# Altium schematic sheet [03] - BUTTONS-AND-SPI.SchDoc
size A3; DocumentNumber: 3; SheetNumber: 3; SheetTotal: 6
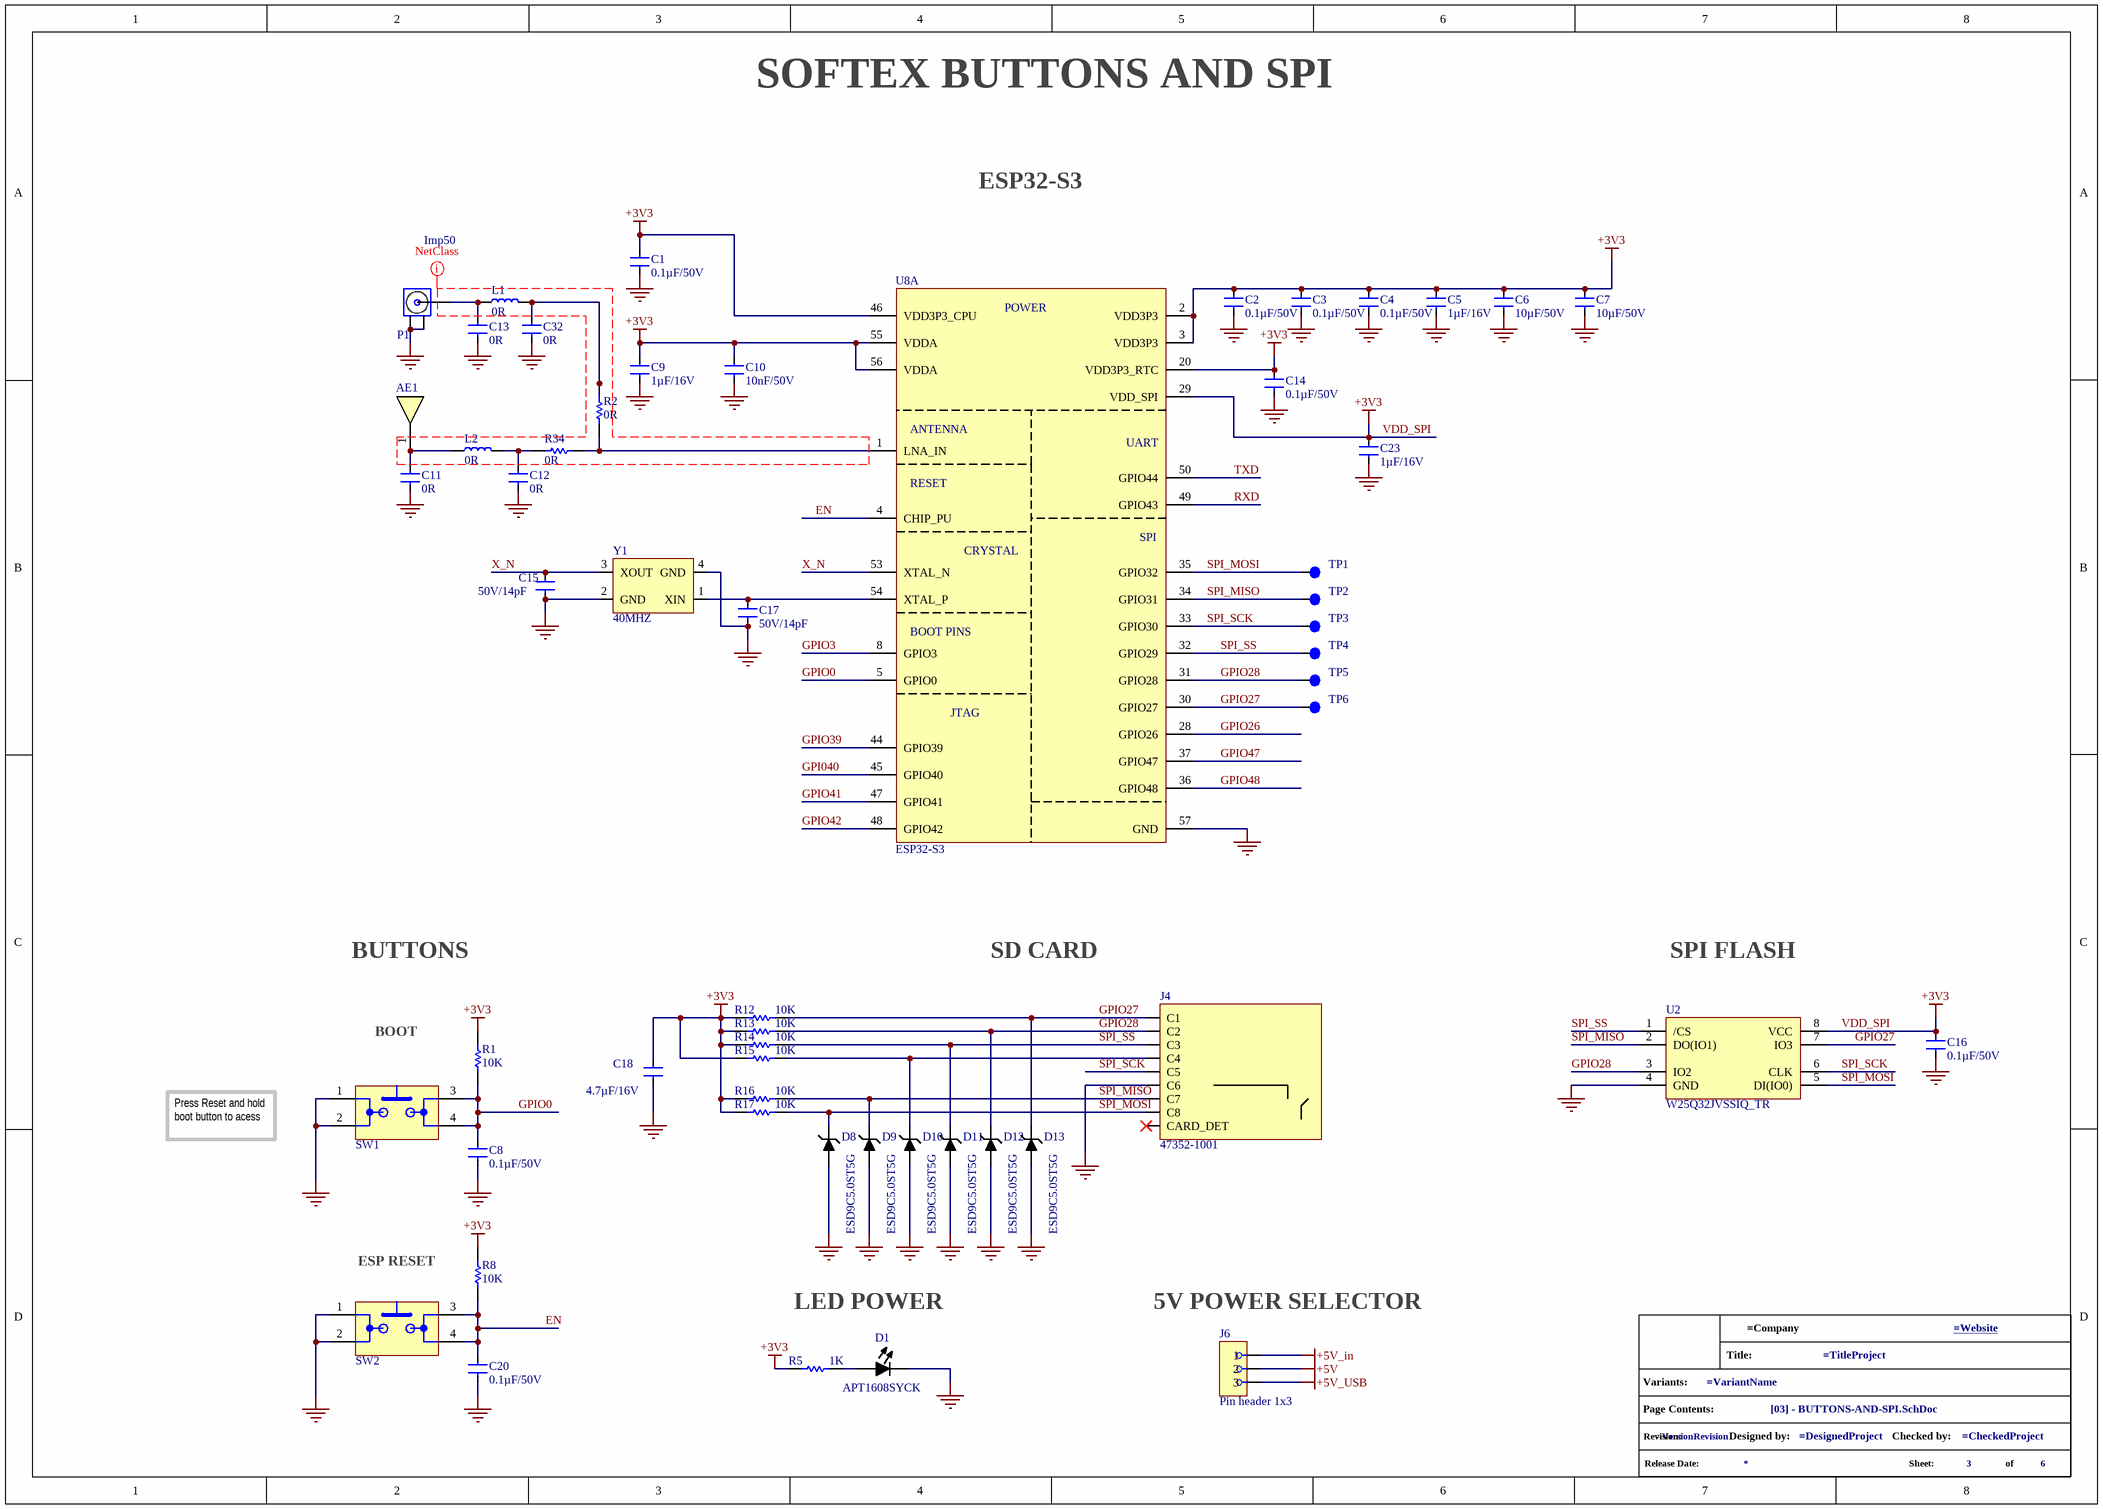
[diagram p0: [03] - BUTTONS-AND-SPI.SchDoc]

## Parts
*?  info_project  (value not drawn)  (graphical)
AE1  2450AT45A100E  [2450AT45A100E]  (value not drawn)
C1  0.1µF/50V  [C0805]
C2  0.1µF/50V  [C0805]
C3  0.1µF/50V  [C0805]
C4  0.1µF/50V  [C0805]
C5  1µF/16V  [C0805]
C6  10µF/50V  [C0805]
C7  10µF/50V  [C0805]
C8  0.1µF/50V  [C0805]
C9  1µF/16V  [C0805]
C10  10nF/50V  [C0805]
C11  0R  [C0402]
C12  0R  [C0402]
C13  0R  [C0402]
C14  0.1µF/50V  [C0805]
C15  50V/14pF  [C0402]
C16  0.1µF/50V  [C0805]
C17  50V/14pF  [C0402]
C18  4.7µF/16V  [C0805]
C20  0.1µF/50V  [C0805]
C23  1µF/16V  [C0805]
C32  0R  [C0402]
D1  APT1608SYCK  [APT1608SYCK]
D8  ESD9C5.0ST5G  [ESD9C5.0ST5G]
D9  ESD9C5.0ST5G  [ESD9C5.0ST5G]
D10  ESD9C5.0ST5G  [ESD9C5.0ST5G]
D11  ESD9C5.0ST5G  [ESD9C5.0ST5G]
D12  ESD9C5.0ST5G  [ESD9C5.0ST5G]
D13  ESD9C5.0ST5G  [ESD9C5.0ST5G]
J4  47352-1001  [SDCARD-0473521001]
J6  Pin header 1x3  [PH1-03-UA]
L1  0R  [L0402]
L2  0R  [L0402]
P1  U.FL-R-SMT-1(10)  [U.FL-R-SMT-1(10)]  (value not drawn)
R1  10K  [R0805]
R2  0R  [R0402]
R5  1K  [R0805]
R8  10K  [R0805]
R12  10K  [R0805]
R13  10K  [R0805]
R14  10K  [R0805]
R15  10K  [R0805]
R16  10K  [R0805]
R17  10K  [R0805]
R34  0R  [R0402]
SW1  BUTTON  [BUTTON]  (value not drawn)
SW2  BUTTON  [BUTTON]  (value not drawn)
TP1  TestPoint  [Test Point]  (value not drawn)  (no BOM)
TP2  TestPoint  [Test Point]  (value not drawn)  (no BOM)
TP3  TestPoint  [Test Point]  (value not drawn)  (no BOM)
TP4  TestPoint  [Test Point]  (value not drawn)  (no BOM)
TP5  TestPoint  [Test Point]  (value not drawn)  (no BOM)
TP6  TestPoint  [Test Point]  (value not drawn)  (no BOM)
U2  W25Q32JVSSIQ_TR  [SOIC127P790X216-8N]
U8  ESP32-S3  [ESP32-S3]  (part A of 2)
Y1  40MHZ  [RH100-40.000-10-F-1010-TR]

## Nets
+5V: J6.2
+5V_in: J6.1
+5V_USB: J6.3
GND: C1.1 C2.1 C3.1 C4.1 C5.1 C6.1 C7.1 C8.1 C9.1 C10.1 C11.1 C12.1 C13.1 C14.2 C15.1 C16.1 C17.1 C18.1 C20.1 C23.1 C32.1 D1.2 D8.2(Anode) D9.2(Anode) D10.2(Anode) D11.2(Anode) D12.2(Anode) D13.2(Anode) J4.6(C6) P1.2 P1.3 SW1.1 SW1.2 SW2.1 SW2.2 U2.4(GND) U8.57(GND) Y1.2(GND) Y1.4(GND)
VDD_SPI: C1.2 C2.2 C3.2 C4.2 C5.2 C6.2 C7.2 C9.2 C10.2 C14.1 C16.2 C18.2 C23.2 R1.2 R5.1 R8.2 R12.1 R13.1 R14.1 R15.1 R16.1 R17.1 U2.8(VCC) U8.2(VDD3P3) U8.3(VDD3P3) U8.20(VDD3P3_RTC) U8.29(VDD_SPI) U8.46(VDD3P3_CPU) U8.55(VDDA) U8.56(VDDA)  [also labelled +3V3]
EN: C20.2 R8.1 SW2.3 SW2.4 U8.4(CHIP_PU)
GPI040: U8.45(GPIO40)
GPIO0: C8.2 R1.1 SW1.3 SW1.4 U8.5(GPIO0)
GPIO3: U8.8(GPIO3)
GPIO26: U8.28(GPIO26)
GPIO27: D13.1(Cathode) J4.1(C1) R12.2 TP6.1 U2.7(IO3) U8.30(GPIO27)
GPIO28: D12.1(Cathode) J4.2(C2) R13.2 TP5.1 U2.3(IO2) U8.31(GPIO28)
GPIO39: U8.44(GPIO39)
GPIO41: U8.47(GPIO41)
GPIO42: U8.48(GPIO42)
GPIO47: U8.37(GPIO47)
GPIO48: U8.36(GPIO48)
RXD: U8.49(GPIO43)
SPI_MISO: D9.1(Cathode) J4.7(C7) R16.2 TP2.1 U2.2(DO(IO1)) U8.34(GPIO31)
SPI_MOSI: D8.1(Cathode) J4.8(C8) R17.2 TP1.1 U2.5(DI(IO0)) U8.35(GPIO32)
SPI_SCK: J4.5(C5) TP3.1 U2.6(CLK) U8.33(GPIO30)
SPI_SS: D11.1(Cathode) J4.3(C3) R14.2 TP4.1 U2.1(/CS) U8.32(GPIO29)
TXD: U8.50(GPIO44)
X_N: C15.2 U8.53(XTAL_N) Y1.3(XOUT)
NetAE1_1: AE1.1(Feeding_Point) C11.2 L2.1
NetC12_2: C12.2 L2.2 R34.2
NetC13_2: C13.2 L1.1 P1.1
NetC17_2: C17.2 U8.54(XTAL_P) Y1.1(XIN)
NetC32_2: C32.2 L1.2 R2.2
NetD1_1: D1.1 R5.2
NetD10_1: D10.1(Cathode) J4.4(C4) R15.2
NetR2_1: R2.1 R34.1 U8.1(LNA_IN)

Not connected (* = marked no-connect by the designer): J4 9(CARD_DET)*

## Layout directives
net class Imp50: +3V3, GND

## Notes on the sheet
- SOFTEX BUTTONS AND SPI
- ESP32-S3
- BUTTONS
- SD CARD
- SPI FLASH
- BOOT
- Press Reset and hold boot button to acess bootloader
- ESP RESET
- LED POWER
- (near J6) 5V POWER SELECTOR
- (in symbol ESP32-S3, part A) POWER; ANTENNA; UART; RESET; SPI; CRYSTAL; BOOT PINS; JTAG
- (in symbol info_project) Title:; Variants:; Page Contents:; Revision:; Designed by:; Checked by:; Release Date:; Sheet:; of

## Library data of the parts
*? = info_project: GRAPHICAL - Info Project
AE1 = 2450AT45A100E: RF ANT - 2.4GHZ CHIP SOLDER SMD; Manufacturer 1: Johanson; Impedance: 50R; Power Rating: 3W; Bandwidth: 100MHz; Number of Bands: 1; Return Loss: -9.5dB; Frequency: 2.45GHz; Gain: 1dB; Max Frequency: 2.5GHz; .SCHChecked: Alex Batista; Supplier 1: Digi-Key; Manufacturer Part Number 1: 2450AT45A100E; Stock 1: 275; Pricing 1: 1=0.94000, 10=0.84100, 25=0.79800, 100=0.65550, 250=0.61276, 500=0.54150 (USD); RoHS: Yes; Mount: Surface Mount; Number of Pins: 2; Min Operating Temperature: -40°C; Max Operating Temperature: 85°C; Package Quantity: 1; Packaging: Tape and Reel; Max Power Dissipation: 3W; Termination: Solder; Resistor Type: Ceramic; Length: 9.5mm; Width: 2mm; Height: 0.047inch; Radiation Hardening: No; REACH SVHC: No SVHC; ComponentLink1URL: https://datasheet.ciiva.com/1126/1296113-1126176.pdf?src-supplier=Newark; ComponentLink1Description: https://datasheet.ciiva.com/1126/1296113-1126176.pdf?src-supplier=Newark; ComponentLink2URL: https://datasheet.ciiva.com/2791/jti-antenna-2450at45a100-2006-07-2791936.pdf?src-supplier=Digi-Key; ComponentLink2Description: https://datasheet.ciiva.com/2791/jti-antenna-2450at45a100-2006-07-2791936.pdf?src-supplier=Digi-Key; ComponentLink3URL: https://datasheet.ciiva.com/6748/antenna-2450at45a100-v5-6748578.pdf?src-supplier=Newark; ComponentLink3Description: https://datasheet.ciiva.com/6748/antenna-2450at45a100-v5-6748578.pdf?src-supplier=Newark; ComponentLink4URL: https://datasheet.ciiva.com/24068/antenna-2450at45a100-v5-242465-24068002.pdf?src-supplier=Mouser; ComponentLink4Description: https://datasheet.ciiva.com/24068/antenna-2450at45a100-v5-242465-24068002.pdf?src-supplier=Mouser; ComponentLink5URL: https://datasheet.ciiva.com/2791/jti-antenna-2450at45a100-2006-07-2791937.pdf?src-supplier=Digi-Key; ComponentLink5Description: https://datasheet.ciiva.com/2791/jti-antenna-2450at45a100-2006-07-2791937.pdf?src-supplier=Digi-Key; ComponentLink6URL: https://datasheet.ciiva.com/2791/jti-antenna-2450at45a100-2006-07-2791938.pdf?src-supplier=Digi-Key; ComponentLink6Description: https://datasheet.ciiva.com/2791/jti-antenna-2450at45a100-2006-07-2791938.pdf?src-supplier=Digi-Key; ComponentLink7URL: https://datasheet.ciiva.com/1124/1318299-1124920.pdf?src-supplier=Element14; ComponentLink7Description: https://datasheet.ciiva.com/1124/1318299-1124920.pdf?src-supplier=Element14; Supplier Part Number 1: 712-1012-1-ND; .PCBChecked: Alex Batista
C1-C4 C8 C14 C16 C20 = CL21B104KBCNNNC: MLCC - 0.1µF 0805 50V X7R ±10%; Manufacturer 1: Samsung; .SCHChecked: Victor Holanda; Material: Ceramic; Capacitance: 100nF; .PCBChecked: Victor Holanda; Supplier 1: Digi-Key; RoHS: Yes; Category: Ceramic Capacitors; Stock 1: 3198898; Pricing 1: 1=0,10000, 10=0,04800, 50=0,02620, 100=0,02140, 500=0,01528, 1000=0,01201 (USD); Mount: Surface Mount; Case/Package: 0805; Case Code (Metric): 2012; Case Code (Imperial): 0805; Contact Plating: Tin; Min Operating Temperature: -55°C; Max Operating Temperature: 125°C; Tolerance: 10%; Dielectric: X7R; Packaging: Tape and Reel; Voltage Rating: 50V; Voltage: 50V; Voltage Rating (DC): 50V; Series: CL; Construction: Flat; Length: 2mm; Width: 0.049inch; Height: 0.85mm; Depth: 1.25mm; Thickness: 0.037inch; Radiation Hardening: No; Lead Free: Lead Free; RoHS Compliant: Yes; ComponentLink3URL: https://datasheet.ciiva.com/25710/cl21b104kbcnnnc-25710182.pdf?src-supplier=Digi-Key; ComponentLink3Description: https://datasheet.ciiva.com/25710/cl21b104kbcnnnc-25710182.pdf?src-supplier=Digi-Key; Supplier 2: Mouser; Supplier Part Number 1: 1276-1003-1-ND; Supplier Part Number 2: 187-CL21B104KBCNNNC; Manufacturer Part Number 1: CL21B104KBCNNNC
C5 C9 C23 = CL21B105KOFNNNE: MLCC - 1µF 0805 16V X7R ±10%; Manufacturer 1: Samsung; .SCHChecked: Victor Holanda; Capacitance: 1uF; .PCBChecked: Victor Holanda; Supplier 1: Digi-Key; RoHS: Yes; Category: Ceramic Capacitors; Stock 1: 1044699; Pricing 1: 1=0,10000, 10=0,05600, 50=0,03060, 100=0,02500, 500=0,01782, 1000=0,01401 (USD); Mount: Surface Mount; Case/Package: 0805; Case Code (Metric): 2012; Case Code (Imperial): 0805; Contact Plating: Tin; Min Operating Temperature: -55°C; Max Operating Temperature: 125°C; Tolerance: 10%; Package Quantity: 1; Packaging: Tape and Reel; Voltage Rating: 16V; Dielectric: X7R; Voltage Rating (DC): 16V; Series: CL; Construction: Flat; Voltage: 16V; Length: 2mm; Width: 0.049inch; Height: 1.25mm; Thickness: 0.053inch; Depth: 1.25mm; Radiation Hardening: No; Lead Free: Lead Free; RoHS Compliant: Yes; ComponentLink3URL: https://datasheet.ciiva.com/25800/cl21b105kofnnne-25800257.pdf?src-supplier=Digi-Key; ComponentLink3Description: https://datasheet.ciiva.com/25800/cl21b105kofnnne-25800257.pdf?src-supplier=Digi-Key; Supplier Part Number 1: 1276-1026-1-ND; Manufacturer Part Number 1: CL21B105KOFNNNE
C6 C7 = GRM21BR61H106ME43L: MLCC - 10µF 0805 50V X7R ±20%; Manufacturer  1: Murata; .SCHChecked: Victor Holanda; .PCBChecked: Victor Holanda; Supplier 1: Digi-Key; RoHS: Yes; Category: Ceramic Capacitors; Stock 1: 199741; Pricing 1: 1=0,42000, 10=0,29400, 50=0,20560, 100=0,17620, 500=0,13216, 1000=0,11161 (USD); Supplier Part Number 1: 490-18664-1-ND; Manufacturer Part Number 1: GRM21BR61H106ME43L
C10 = CL21B103KBCNNNC: MLCC - 10nF 0805 50V X7R ±10%; Manufacturer 1: Samsung; .SCHChecked: Victor Holanda; .PCBChecked: Victor Holanda; Supplier 1: Digi-Key; RoHS: Yes; Category: Ceramic Capacitors; Stock 1: 106601; Pricing 1: 1=0,10000, 10=0,05000, 50=0,02700, 100=0,02210, 500=0,01578, 1000=0,01240 (USD); Mount: Surface Mount; Case/Package: 0805; Case Code (Metric): 2012; Case Code (Imperial): 0805; Contact Plating: Tin; Min Operating Temperature: -55°C; Max Operating Temperature: 125°C; Voltage Rating: 50V; Packaging: Tape and Reel; Capacitance: 10nF; Tolerance: 10%; Dielectric: X7R; Voltage Rating (DC): 50V; Series: CL; Construction: Flat; Length: 2mm; Width: 0.049inch; Height: 0.85mm; Thickness: 0.037inch; Depth: 1.25mm; Radiation Hardening: No; Lead Free: Lead Free; RoHS Compliant: Yes; ComponentLink6URL: https://datasheet.ciiva.com/26920/getdatasheetpartid-640087-26920198.pdf?src-supplier=Verical; ComponentLink6Description: https://datasheet.ciiva.com/26920/getdatasheetpartid-640087-26920198.pdf?src-supplier=Verical; Supplier Part Number 1: 1276-1078-1-ND; Manufacturer Part Number 1: CL21B103KBCNNNC
C11-C13 C32 = C_0402_JUMPER: MLCC - 0R 0402 JUMPER; Manufacturer 1: Vishay; Manufacturer Part Number 1: CRCW04020000Z0EDC; .SCHChecked: Victor Holanda; Power Rating: 62.5mW; Resistance: 18R; .PCBChecked: Victor Holanda; Supplier 1: Digi-Key; RoHS: Yes; Category: Chip SMD Resistors; Stock 1: 109511; Pricing 1: 1=0,10000, 10=0,02300, 100=0,00950, 1000=0,00427, 2500=0,00370, 5000=0,00306 (USD); Mount: Surface Mount; Case/Package: Molded; Contact Plating: Tin; Min Operating Temperature: -55°C; Max Operating Temperature: 155°C; Resistor Type: Thick Film; Termination: Wraparound; Length: 1mm; Lead Free: Lead Free; RoHS Compliant: Yes; ComponentLink1URL: http://www.vishay.com/docs/28773/crcwce3.pdf?src-supplier=Digi-Key; ComponentLink1Description: http://www.vishay.com/docs/28773/crcwce3.pdf?src-supplier=Digi-Key; ComponentLink2URL: http://www.vishay.com/docs/20035/dcrcwe3.pdf?src-supplier=Avnet; ComponentLink2Description: http://www.vishay.com/docs/20035/dcrcwe3.pdf?src-supplier=Avnet; Supplier Part Number 1: 541-4062-1-ND
C15 C17 = 04025U140FAT2A: MLCC - 14pF 0402 50V NP0 ±1%; Manufacturer 1: Kyocera AVX; Dielectric: C0G; .PCBChecked: Victor H; Supplier 1: Digi-Key; Manufacturer Part Number 1: 04025U140FAT2A; RoHS: Yes; Category: Ceramic Capacitors; Stock 1: 104186; Pricing 1: 1=0,37000, 10=0,25100, 50=0,16760, 100=0,14250, 500=0,10058, 1000=0,08801, 2500=0,08382, 5000=0,07753 (USD); Mount: Surface Mount; Case/Package: 0402; Case Code (Imperial): 0402; Case Code (Metric): 1005; Min Operating Temperature: -55°C; Max Operating Temperature: 125°C; Capacitance: 14pF; Package Quantity: 10000; Voltage Rating: 50V; Voltage Rating (DC): 50V; Tolerance: 1%; Packaging: Tape and Reel; Termination: SMD/SMT; Resistor Type: Ceramic; Series: U; Construction: Flat; Length: 1mm; Width: 0.5mm; Thickness: 0.022inch; Depth: 0.5mm; Radiation Hardening: No; RoHS Compliant: Yes; ComponentLink1URL: https://datasheet.ciiva.com/11568/useries-11568551.pdf?src-supplier=Avnet; ComponentLink1Description: https://datasheet.ciiva.com/11568/useries-11568551.pdf?src-supplier=Avnet; ComponentLink2URL: https://datasheet.ciiva.com/6269/useries-6269558.pdf?src-supplier=Digi-Key; ComponentLink2Description: https://datasheet.ciiva.com/6269/useries-6269558.pdf?src-supplier=Digi-Key; Supplier Part Number 1: 478-10139-1-ND; .SCHChecked: Victor H
C18 = CL21A475KOFNNNE: MLCC - 4.7µF 0805 16V X5R ±10%; Manufacturer 1: Samsung; .SCHChecked: Victor Holanda; Capacitance: 4.7uF; .PCBChecked: Victor Holanda; Supplier 1: Digi-Key; Manufacturer Part Number 1: CL21A475KOFNNNE; RoHS: Yes; Category: Ceramic Capacitors; Stock 1: 605133; Pricing 1: 1=0,12000, 10=0,08600, 50=0,04880, 100=0,04050, 500=0,02838, 1000=0,02350 (USD); Mount: Surface Mount; Case/Package: 0805; Case Code (Metric): 2012; Case Code (Imperial): 0805; Contact Plating: Tin; Min Operating Temperature: -55°C; Max Operating Temperature: 85°C; Packaging: Tape and Reel; Tolerance: 10%; Voltage Rating: 16V; Dielectric: X5R; Series: CL; Construction: Flat; Length: 2mm; Width: 0.049inch; Height: 1.25mm; Thickness: 0.053inch; Depth: 1.25mm; Radiation Hardening: No; RoHS Compliant: Yes; ComponentLink3URL: https://datasheet.ciiva.com/25710/cl21a475kofnnne-25710354.pdf?src-supplier=Digi-Key; ComponentLink3Description: https://datasheet.ciiva.com/25710/cl21a475kofnnne-25710354.pdf?src-supplier=Digi-Key; ComponentLink4URL: https://datasheet.ciiva.com/16740/cl21a475kofnnne-16740646.pdf?src-supplier=Future+Electronics; ComponentLink4Description: https://datasheet.ciiva.com/16740/cl21a475kofnnne-16740646.pdf?src-supplier=Future+Electronics; ComponentLink5URL: https://datasheet.ciiva.com/26838/getdatasheetpartid-357424-26838625.pdf?src-supplier=Verical; ComponentLink5Description: https://datasheet.ciiva.com/26838/getdatasheetpartid-357424-26838625.pdf?src-supplier=Verical; Supplier Part Number 1: 1276-1065-1-ND
D1 = APT1608SYCK: LED - APT1608SYCK Yellow LED; 590 nm 1608 (0603) Clear; Rectangle Lens SMD package; Manufacturer: Kingbright; .SCHChecked: Victor H; Viewing Angle: 120°; Forward Current: 20mA; Forward Voltage: 2V; Luminous Intensity: 150mcd; Dominant Wavelength: 590nm; Lens Style: Clear,Flat; Number of LEDs: 1; .PCBChecked: Victor H; mounting: SMD; Supplier 1: Digi-Key; Manufacturer Part Number: APT1608SYCK; RoHS: Yes; Category: LEDs; Stock 1: 448438; Pricing 1: 1=0,31000, 10=0,24100, 100=0,10840, 500=0,09794, 1000=0,08045 (USD); Mount: Surface Mount; Case/Package: 0603; Number of Pins: 2; Lens Color: Clear; Color: Yellow; Case Code (Metric): 1608; Case Code (Imperial): 0603; Min Operating Temperature: -40°C; Max Operating Temperature: 85°C; Package Quantity: 2000; Packaging: Tape and Reel; Illumination Color: Yellow; Test Current: 20mA; Wavelength: 590nm; Series: APT; Length: 1.6mm; Width: 0.8mm; Height: 0.75mm; Lead Free: Lead Free; RoHS Compliant: Yes; ComponentLink1URL: https://datasheet.ciiva.com/2113/apt1608syck-2113824.pdf?src-supplier=Digi-Key; ComponentLink1Description: https://datasheet.ciiva.com/2113/apt1608syck-2113824.pdf?src-supplier=Digi-Key; ComponentLink2URL: https://datasheet.ciiva.com/4688/apt1608syck-35136-4688900.pdf?src-supplier=Mouser; ComponentLink2Description: https://datasheet.ciiva.com/4688/apt1608syck-35136-4688900.pdf?src-supplier=Mouser; ComponentLink3URL: https://datasheet.ciiva.com/2113/apt1608syck-2113825.pdf?src-supplier=Digi-Key; ComponentLink3Description: https://datasheet.ciiva.com/2113/apt1608syck-2113825.pdf?src-supplier=Digi-Key; ComponentLink4URL: https://datasheet.ciiva.com/2113/apt1608syck-2113826.pdf?src-supplier=Digi-Key; ComponentLink4Description: https://datasheet.ciiva.com/2113/apt1608syck-2113826.pdf?src-supplier=Digi-Key; ComponentLink5URL: https://datasheet.ciiva.com/14603/70062842-14603786.pdf?src-supplier=Allied+Electronics; ComponentLink5Description: https://datasheet.ciiva.com/14603/70062842-14603786.pdf?src-supplier=Allied+Electronics; Supplier Part Number 1: 754-1124-1-ND
D8-D13 = ESD9C5.0ST5G: DIODE - TVS 5V SOD923; Manufacturer: ON Semiconductor; Capacitance: 6.2pF; Number of Elements: 1; Reverse Breakdown Voltage: 11V; Direction: Unidirectional; Power Line Protection: No; Leakage Current: 500nA; Test Current: 1mA; Max Power Dissipation: 150mW; Clamping Voltage: 10V; ESD Protection: Yes; Element Configuration: Single; Diode Type: ZENER; .SCHChecked: Alex Batista; Supplier 1: Digi-Key; Manufacturer Part Number: ESD9C5.0ST5G; RoHS: Yes; Category: ESD and Circuit Protection ICs; Stock 1: 4445; Pricing 1: 1=0,32000, 10=0,25900, 100=0,13720, 500=0,09024, 1000=0,06136, 2000=0,05535 (USD); Case/Package: SOD-923-2; Number of Pins: 2; Min Operating Temperature: -55°C; Max Operating Temperature: 150°C; Package Quantity: 1; Number of Channels: 1; Operating Supply Voltage: 5V; Packaging: Tape and Reel; Number of Unidirectional Channels: 1; Reverse Standoff Voltage: 5V; Min Breakdown Voltage: 11V; Breakdown Voltage: 11V; Polarity: Unidirectional; Termination: SMD/SMT; Working Voltage: 5V; Max Breakdown Voltage: 11V; Peak Pulse Power: 150mW; Max Reverse Leakage Current: 500nA; Number of Lines: 1; Resistor Type: Zener; Series: Automotive, AEC-Q101; Clamping Voltage-Max: 10V; Length: 0.8mm; Width: 0.65mm; Height: 0.4mm; Depth: 0.6mm; Radiation Hardening: No; REACH SVHC: No SVHC; Lead Free: Lead Free; Halogen Free: Halogen Free; RoHS Compliant: Yes; ComponentLink1URL: https://datasheet.ciiva.com/1219/1748974-1219321.pdf?src-supplier=Newark; ComponentLink1Description: https://datasheet.ciiva.com/1219/1748974-1219321.pdf?src-supplier=Newark; ComponentLink2URL: https://datasheet.ciiva.com/4509/esd9c3-3s-d-241629-4509822.pdf?src-supplier=Mouser; ComponentLink2Description: https://datasheet.ciiva.com/4509/esd9c3-3s-d-241629-4509822.pdf?src-supplier=Mouser; ComponentLink3URL: https://datasheet.ciiva.com/15143/getdatasheetpartid-53763-15143125.pdf?src-supplier=Verical; ComponentLink3Description: https://datasheet.ciiva.com/15143/getdatasheetpartid-53763-15143125.pdf?src-supplier=Verical; ComponentLink4URL: https://datasheet.ciiva.com/339/esd9c3-3s-d-339778.pdf?src-supplier=Digi-Key; ComponentLink4Description: https://datasheet.ciiva.com/339/esd9c3-3s-d-339778.pdf?src-supplier=Digi-Key; ComponentLink5URL: https://datasheet.ciiva.com/11195/esd9c3-3s-d-11195341.pdf?src-supplier=Avnet; ComponentLink5Description: https://datasheet.ciiva.com/11195/esd9c3-3s-d-11195341.pdf?src-supplier=Avnet; ComponentLink6URL: https://datasheet.ciiva.com/339/esd9c3-3s-d-339779.pdf?src-supplier=Digi-Key; ComponentLink6Description: https://datasheet.ciiva.com/339/esd9c3-3s-d-339779.pdf?src-supplier=Digi-Key; ComponentLink7URL: https://datasheet.ciiva.com/339/esd9c3-3s-d-339780.pdf?src-supplier=Digi-Key; ComponentLink7Description: https://datasheet.ciiva.com/339/esd9c3-3s-d-339780.pdf?src-supplier=Digi-Key; Supplier Part Number 1: ESD9C5.0ST5GOSCT-ND; .PCBChecked: Alex Batista
J4 = 47352-1001: CONN - Micro SD Card HDR 8 POS 1.1mm Solder RA SMD 0.5A/Contact Embossed T/R; Manufacturer 1: Molex; Number of Contacts: 8; Gender: Male; Connector Type: Connector; Max Voltage Rating (DC): 100V; Current Rating: 500mA; .SCHChecked: Alex Batista; Supplier 1: Digi-Key; RoHS: Yes; Category: Memory Connectors; Stock 1: 14775; Pricing 1: 1=3,58000, 10=3,15500, 100=2,50930 (USD); Mount: Surface Mount; Contact Material: Stainless Steel,Copper Alloy,Copper; Contact Plating: Gold; Housing Material: Polymer; Min Operating Temperature: -20°C; Max Operating Temperature: 85°C; Number of Rows: 1; Packaging: Tape and Reel; Orientation: Right Angle; Package Quantity: 1; Termination: SMD/SMT; Series: 47352; Voltage Rating (DC): 100V; Length: 14mm; Width: 1.88mm; Pitch: 1.1mm; Depth: 15.2mm; Radiation Hardening: No; REACH SVHC: Unknown; ComponentLink1URL: https://datasheet.ciiva.com/683/473521001-sd-683625.pdf?src-supplier=Digi-Key; ComponentLink1Description: https://datasheet.ciiva.com/683/473521001-sd-683625.pdf?src-supplier=Digi-Key; ComponentLink2URL: https://datasheet.ciiva.com/11755/0900766b80f75287-11755041.pdf?src-supplier=RSComponents; ComponentLink2Description: https://datasheet.ciiva.com/11755/0900766b80f75287-11755041.pdf?src-supplier=RSComponents; ComponentLink3URL: https://datasheet.ciiva.com/16547/0473521001-memory-card-socket-16547169.pdf?src-supplier=Avnet+Europe; ComponentLink3Description: https://datasheet.ciiva.com/16547/0473521001-memory-card-socket-16547169.pdf?src-supplier=Avnet+Europe; ComponentLink4URL: https://datasheet.ciiva.com/30105/0473521001-memory-card-socket-30105258.pdf?src-supplier=Onlinecomponents.com; ComponentLink4Description: https://datasheet.ciiva.com/30105/0473521001-memory-card-socket-30105258.pdf?src-supplier=Onlinecomponents.com; ComponentLink5URL: https://datasheet.ciiva.com/683/473521001-sd-683627.pdf?src-supplier=Digi-Key; ComponentLink5Description: https://datasheet.ciiva.com/683/473521001-sd-683627.pdf?src-supplier=Digi-Key; Supplier 2: Mouser; Pricing 2: 1=3,58000, 10=3,16000, 50=3,16000, 100=2,66000, 1000=2,16000, 10000=2,15000 (USD); Supplier Part Number 1: WM3290CT-ND; Supplier Part Number 2: 538-47352-1001; .PCBChecked: Alex Batista; Manufacturer Part Number 1: 47352-1001
J6 = PH1-03-UA: CONN - HEADER VERT 3POS 2.54MM; Manufacturer 1: Adam Equipment; Number of Positions: 3; .SCHChecked: Victor H; Supplier 1: Digi-Key; Manufacturer Part Number 1: PH1-03-UA; RoHS: Yes; Category: Connectors; Stock 1: 48736; Pricing 1: 1=0,10000, 10=0,05000, 100=0,03650, 500=0,03024, 1000=0,02646, 5000=0,02268, 10000=0,02205 (USD); Pitch: 2.54mm; Lead Free: Lead Free; ComponentLink1URL: https://datasheet.ciiva.com/16396/catpg240-254-16396026.pdf?src-supplier=Future+Electronics; ComponentLink1Description: https://datasheet.ciiva.com/16396/catpg240-254-16396026.pdf?src-supplier=Future+Electronics; Supplier Part Number 1: 2057-PH1-03-UA-ND; .PCBChecked: Victor H
L1 L2 = L_0402_JUMPER: IND - 0R 0402 JUMPER; Manufacturer 1: Vishay; Manufacturer Part Number 1: CRCW04020000Z0EDC; Power Rating: 62.5mW; Resistance: 18R; .SCHChecked: Alex Batista; Supplier 1: Mouser; Stock 1: 1494844; Pricing 1: 1=0.13, 10=0.044, 50=0.044, 100=0.025, 1000=0.018, 10000=0.005 (USD); Mount: Surface Mount; Case/Package: Molded; Contact Plating: Tin; Min Operating Temperature: -55°C; Max Operating Temperature: 155°C; Composition: Thick Film; Termination: Wraparound; Length: 1mm; Lead Free: Lead Free; Supplier Part Number 1: 71-CRCW04020000Z0EDC; .PCBChecked: Alex Batista
P1 = U.FL-R-SMT-1(10): Connector - UFL; Manufacturer 1: Hirose; Body Material: Bronze; Body Plating: Silver; Dielectric Material: Polymer; Impedance: 50R; Connector Type: Coaxial,Receptacle,Male Pin; Frequency: 6GHz; Insulation Resistance: 500MR; Gender: Male; Wire/Cable Type: Coaxial; .SCHChecked: Alex Batista; Supplier 1: Digi-Key; Manufacturer Part Number 1: U.FL-R-SMT-1(10); Stock 1: 249511; Pricing 1: 1=1.310000, 10=1.150000, 25=1.082400, 50=1.037400, 100=0.992200, 250=0.902000, 500=0.811800, 1000=0.721600 (USD); RoHS: Yes; Mount: Surface Mount,Through Hole,PCB; Contact Material: Brass,Bronze; Contact Plating: Gold; Housing Color: Beige; Min Operating Temperature: -40°C; Max Operating Temperature: 90°C; Termination: Solder; Orientation: Straight; Packaging: Tape and Reel; Package Quantity: 2500; Fastening Type: Snap; Max Frequency: 6GHz; Length: 3mm; Depth: 3.1mm; Radiation Hardening: No; REACH SVHC: No SVHC; Lead Free: Lead Free; ComponentLink1URL: https://datasheet.ciiva.com/11762/0900766b8105243f-11762474.pdf?src-supplier=RSComponents; ComponentLink1Description: https://datasheet.ciiva.com/11762/0900766b8105243f-11762474.pdf?src-supplier=RSComponents; ComponentLink2URL: https://datasheet.ciiva.com/7651/91524-7651914.pdf?src-supplier=Element14; ComponentLink2Description: https://datasheet.ciiva.com/7651/91524-7651914.pdf?src-supplier=Element14; ComponentLink3URL: https://datasheet.ciiva.com/7651/91524-7651915.pdf?src-supplier=Element14; ComponentLink3Description: https://datasheet.ciiva.com/7651/91524-7651915.pdf?src-supplier=Element14; Supplier 2: Mouser; Manufacturer 2: Hirose; Manufacturer Part Number 2: U.FL-R-SMT-1(10); Stock 2: 42299; Pricing 2: 1=1.190000, 10=0.984000, 50=0.984000, 100=0.903000, 250=0.820000, 500=0.753000, 1000=0.656000, 2500=0.595000, 10000=0.595000 (USD); Supplier Part Number 1: H11891CT-ND; Supplier Part Number 2: 798-U.FL-R-SMT-110; .PCBChecked: Alex Batista
R1 R8 R12-R17 = RNCP0805FTD10K0: RES - 10K 1/4W 0805 ±1%; Manufacturer 1: Stackpole Electronics; .PCBChecked: Victor Holanda; Resistance: 10kR; Max Power Dissipation: 250mW; Temperature Coefficient: 100ppm/°C; .SCHChecked: Victor Holanda; Supplier 1: Digi-Key; RoHS: Yes; Category: Chip SMD Resistors; Stock 1: 744134; Pricing 1: 1=0,10000, 10=0,07300, 100=0,02970, 1000=0,01336, 2500=0,01159 (USD); Mount: Surface Mount; Case/Package: 0805; Case Code (Metric): 2012; Case Code (Imperial): 0805; Min Operating Temperature: -55°C; Max Operating Temperature: 155°C; Tolerance: 1%; Packaging: Tape and Reel; Resistor Type: Thin Film; Number of Terminations: 2; Features: Moisture Resistant,Anti-Sulfur; Series: RNCP; Length: 0.079inch; Width: 0.049inch; Height: 0.024inch; Lead Free: Lead Free; RoHS Compliant: Yes; ComponentLink7URL: https://www.seielect.com/catalog/SEI-Packaging.pdf?src-supplier=Digi-Key; ComponentLink7Description: https://www.seielect.com/catalog/SEI-Packaging.pdf?src-supplier=Digi-Key; Supplier Part Number 1: RNCP0805FTD10K0CT-ND; Manufacturer Part Number 1: RNCP0805FTD10K0
R2 R34 = RMCF0402ZT0R00: RES - 0R 1/16W 0402; Manufacturer: Stackpole Electronics; .PCBChecked: Victor Holanda; Power Rating: 63mW; Current Rating: 1A; Working Voltage: 50V; .SCHChecked: Victor Holanda; Supplier 1: Digi-Key; Manufacturer Part Number: RMCF0402ZT0R00; RoHS: Yes; Category: Chip SMD Resistors; Stock 1: 13640274; Pricing 1: 1=0,10000, 10=0,01000, 25=0,00720, 50=0,00560, 100=0,00410, 250=0,00316, 500=0,00252, 1000=0,00186, 5000=0,00133 (USD); Mount: Surface Mount; Case/Package: 0402; Case Code (Metric): 1005; Case Code (Imperial): 0402; Contact Plating: Tin,Matte; Min Operating Temperature: -55°C; Max Operating Temperature: 155°C; Resistance: 0R; Packaging: Tape and Reel; Resistor Type: Thick Film; Number of Terminations: 2; Max Power Dissipation: 63mW; Features: Automotive AEC-Q200; Series: RMCF; Technology: THICK FILM; Construction: Rectangular; Length: 0.039inch; Width: 0.02inch; Height: 0.016inch; Depth: 0.5mm; Radiation Hardening: No; Military Standard: Not; Lead Free: Lead Free; RoHS Compliant: Yes; ComponentLink1URL: https://datasheet.ciiva.com/26835/getdatasheetpartid-409751-26835612.pdf?src-supplier=Verical; ComponentLink1Description: https://datasheet.ciiva.com/26835/getdatasheetpartid-409751-26835612.pdf?src-supplier=Verical; Supplier Part Number 1: RMCF0402ZT0R00CT-ND
R5 = RNCP0805FTD1K00: RES - 1K 1/4W 0805 ±1%; Manufacturer 1: Stackpole Electronics; .PCBChecked: Victor Holanda; Resistance: 1kR; Power Rating: 250mW; Temperature Coefficient: 100ppm/°C; .SCHChecked: Victor Holanda; Supplier 1: Digi-Key; RoHS: Yes; Category: Chip SMD Resistors; Stock 1: 333101; Pricing 1: 1=0,10000, 10=0,07300, 100=0,02970, 1000=0,01336, 2500=0,01159 (USD); Mount: Surface Mount; Case/Package: 0805; Case Code (Metric): 2012; Case Code (Imperial): 0805; Size Code: 0805; Min Operating Temperature: -55°C; Max Operating Temperature: 155°C; Tolerance: 1%; Packaging: Tape and Reel; Resistor Type: Thin Film; Number of Terminations: 2; Max Power Dissipation: 250mW; Features: Moisture Resistant,Anti-Sulfur; Series: RNCP; Length: 0.079inch; Width: 0.049inch; Height: 0.024inch; Lead Free: Lead Free; RoHS Compliant: Yes; ComponentLink7URL: http://www.seielect.com/Catalog/SEI-rncp.pdf?src-supplier=Future+Electronics; ComponentLink7Description: http://www.seielect.com/Catalog/SEI-rncp.pdf?src-supplier=Future+Electronics; ComponentLink8URL: https://www.seielect.com/Catalog/SEI-rncp.pdf?src-supplier=Digi-Key; ComponentLink8Description: https://www.seielect.com/Catalog/SEI-rncp.pdf?src-supplier=Digi-Key; ComponentLink9URL: https://www.seielect.com/catalog/SEI-Packaging.pdf?src-supplier=Digi-Key; ComponentLink9Description: https://www.seielect.com/catalog/SEI-Packaging.pdf?src-supplier=Digi-Key; Supplier Part Number 1: RNCP0805FTD1K00CT-ND; Manufacturer Part Number 1: RNCP0805FTD1K00
SW1 SW2 = PTS645SM43SMTR92 LFS: SWITCH TACTILE SPST-NO 0.05A 12V; .PCBChecked: Victor H; Supplier 1: Digi-Key; Supplier Part Number 1: CKN9112CT-ND; .SCHChecked: Victor H
TP1-TP6 = Test_Point: MECH - Test Points
U2 = W25Q32JVSSIQ_TR: IC - NOR Flash Serial (SPI, Dual SPI, Quad SPI) 3V/3.3V 32M-bit 4M x 8 6ns 8-Pin SOIC T/R; Manufacturer 1: Winbond; Manufacturer Part Number 1: W25Q32JVSSIQ TR; Memory Type: FLASH,NOR; Frequency: 104MHz; Interface: SPI,Serial; Supplier 1: Digi-Key; RoHS: Yes; Category: Flash; Stock 1: 124113; Pricing 1: 1=0,94000, 10=0,85700, 25=0,84640, 50=0,84120, 100=0,75220, 250=0,74580, 500=0,73480, 1000=0,70850 (USD); Case/Package: SOIC; Min Operating Temperature: -40°C; Max Operating Temperature: 85°C; Packaging: Tape and Reel; RoHS Compliant: Yes; ComponentLink1URL: http://www.winbond.com/resource-files/w25q32jv%20revg%2003272018%20plus.pdf?src-supplier=Digi-Key; ComponentLink1Description: http://www.winbond.com/resource-files/w25q32jv%20revg%2003272018%20plus.pdf?src-supplier=Digi-Key; Supplier Part Number 1: W25Q32JVSSIQCT-ND
U8 = ESP32-S3: IC - SMD ESP32-S3, Dual-core Mcu,; Manufacturer: Espressif Systems; .SCHChecked: Victor H; .PCBChecked: Victor H; Supplier 1: Digi-Key; Manufacturer Part Number: ESP32-S3; RoHS: No; Stock 1: 2000; Pricing 1: 1=2,04000 (USD); Supplier Part Number 1: 1965-ESP32-S3-ND; mounting: SMD
Y1 = RH100-40.000-10-F-1010-TR: Crystal - 40MHz ±10ppm (Tol) ±10ppm (Stability) 10pF FUND 60Ohm 4-Pin SMD T/R; Manufacturer 1: Raltron Electronics; .SCHChecked: Victor H; Supplier 1: Digi-Key; Manufacturer Part Number 1: RH100-40.000-10-F-1010-TR; RoHS: Yes; Stock 1: 8779; Pricing 1: 1=0,39000, 10=0,32400, 50=0,29180, 100=0,25940, 500=0,24640, 1000=0,20750 (USD); Supplier Part Number 1: 2151-RH100-40.000-10-F-1010-TRCT-ND; .PCBChecked: Victor H